# Altium schematic sheet GİRİŞ.SchDoc
size A3; SheetNumber: 1; SheetTotal: 1
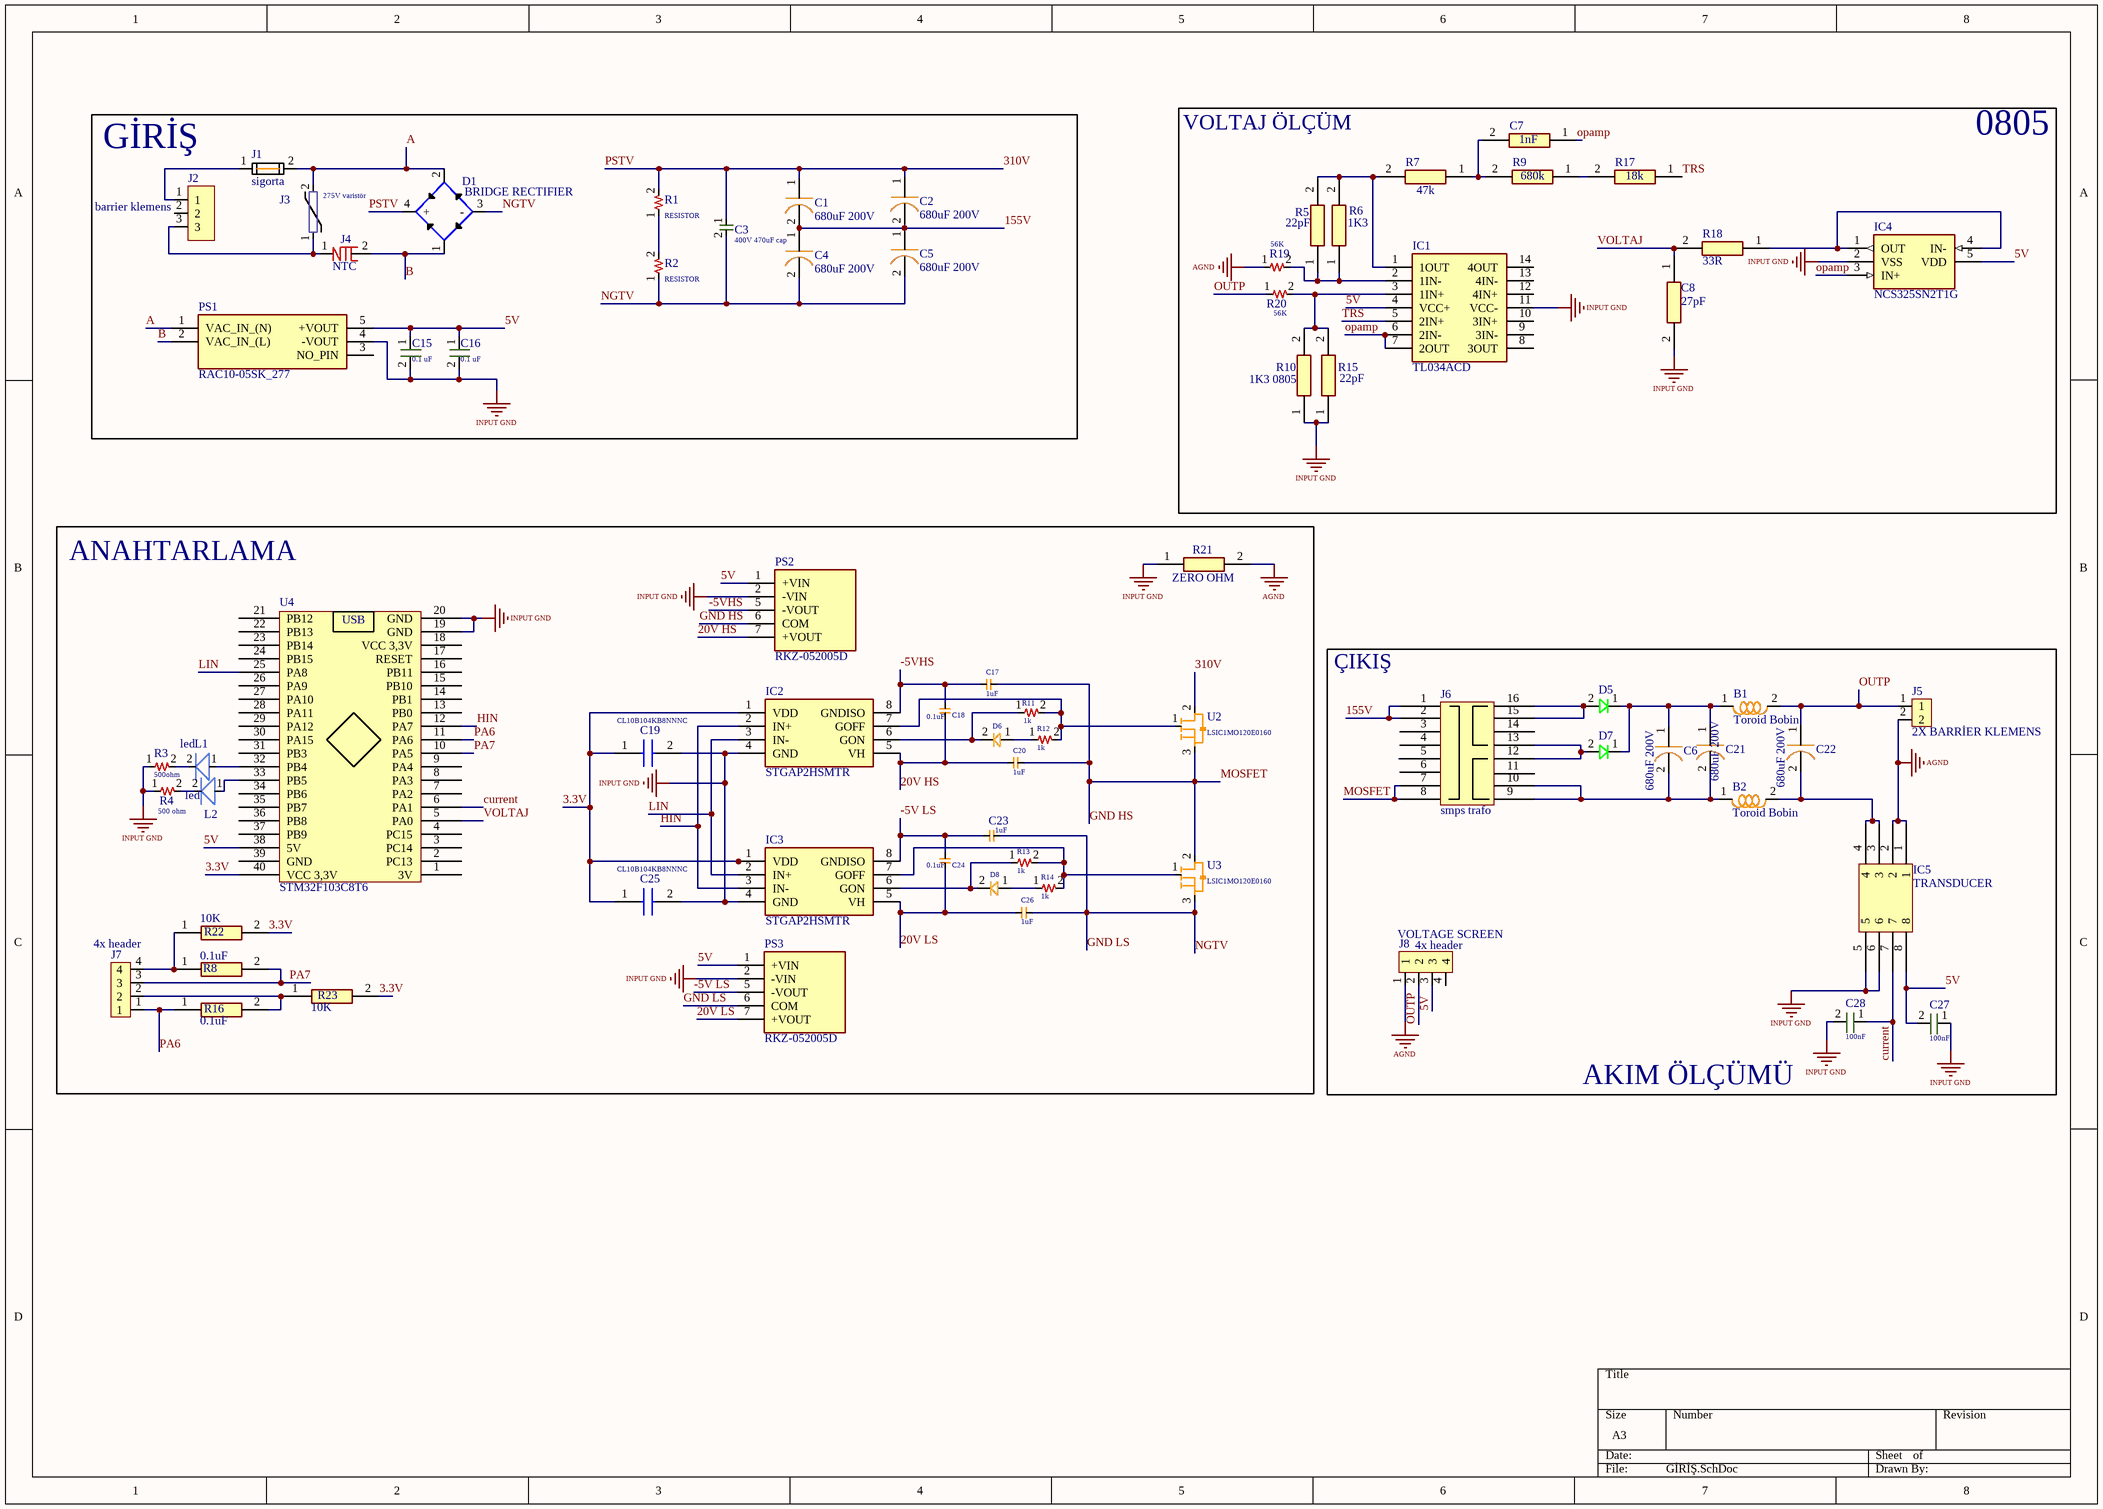
[diagram p0: GİRİŞ.SchDoc]

## Parts
B1  Toroid Bobin  [toroid bobin]
B2  Toroid Bobin  [toroid bobin]
C1  680uF 200V  [200v 680uF CAPACITOR]
C2  680uF 200V  [200v 680uF CAPACITOR]
C3  400V 470uF cap  [400V 470uF]
C4  680uF 200V  [200v 680uF CAPACITOR]
C5  680uF 200V  [200v 680uF CAPACITOR]
C6  680uF 200V  [200v 680uF CAPACITOR]
C7  1nF  [RESC2012X65N]
C8  27pF  [RESC2012X65N]
C15  0.1 uF  [0.1 uF mercimek kapasitör]
C16  0.1 uF  [0.1 uF mercimek kapasitör]
C17  1uF  [KUTU KAPASİTÖR 1uF]
C18  0.1uF  [KUTU KAPASİTÖR 1uF]
C19  CL10B104KB8NNNC  [CAPC1608X90N]
C20  1uF  [KUTU KAPASİTÖR 1uF]
C21  680uF 200V  [200v 680uF CAPACITOR]
C22  680uF 200V  [200v 680uF CAPACITOR]
C23  1uF  [KUTU KAPASİTÖR 1uF]
C24  0.1uF  [KUTU KAPASİTÖR 1uF]
C25  CL10B104KB8NNNC  [CAPC1608X90N]
C26  1uF  [KUTU KAPASİTÖR 1uF]
C27  100nF  [0.1 uF mercimek kapasitör]
C28  100nF  [0.1 uF mercimek kapasitör]
D1  BRIDGE RECTIFIER  [RECTIFIER]
D5  MUR1560 DIODE  [MUR1560 FAST DIODE]  (value not drawn)
D6  SF-26 DIODE  [SF-26 DIODE]  (value not drawn)
D7  MUR1560 DIODE  [MUR1560 FAST DIODE]  (value not drawn)
D8  SF-26 DIODE  [SF-26 DIODE]  (value not drawn)
IC1  TL034ACD  [SOIC127P600X175-14N]
IC2  STGAP2HSMTR  [SOIC127P1032X264-8N]
IC3  STGAP2HSMTR  [SOIC127P1032X264-8N]
IC4  NCS325SN2T1G  [SOT95P275X110-5N]
IC5  TRANSDUCER  [GHS 16-SME current transducer]
J1  sigorta  [FUSE HOLDER]
J2  barrier klemens  [BARRİER KLEMENS]
J3  275V varistör  [Varistor 275V]
J4  NTC  [NTC]
J5  2X BARRİER KLEMENS  [2X BARRİER KLEMENS]
J6  smps trafo  [SMPS TRAFO]
J7  4x header  [4x header]
J8  4x header  [4x header]
L1  led  [led]
L2  led  [led]
PS1  RAC10-05SK_277  [RAC1005SK277]
PS2  RKZ-052005D  [RKZ1215SH]
PS3  RKZ-052005D  [RKZ1215SH]
R1  RESISTOR  [GENERAL RESISTOR]
R2  RESISTOR  [GENERAL RESISTOR]
R3  500ohm  [GENERAL RESISTOR]
R4  500 ohm  [GENERAL RESISTOR]
R5  22pF  [RESC2012X65N]
R6  1K3  [RESC2012X65N]
R7  47k  [RESC2012X65N]
R8  0.1uF  [RESC2012X65N]
R9  680k  [RESC2012X65N]
R10  1K3 0805  [RESC2012X65N]
R11  1k  [GENERAL RESISTOR]
R12  1k  [GENERAL RESISTOR]
R13  1k  [GENERAL RESISTOR]
R14  1k  [GENERAL RESISTOR]
R15  22pF  [RESC2012X65N]
R16  0.1uF  [RESC2012X65N]
R17  18k  [RESC2012X65N]
R18  33R  [RESC2012X65N]
R19  56K  [GENERAL RESISTOR]
R20  56K  [GENERAL RESISTOR]
R21  ZERO OHM  [RESC3216X75N]
R22  10K  [RESC2012X65N]
R23  10K  [RESC2012X65N]
U2  LSIC1MO120E0160  [LSIC1MO120E0160]
U3  LSIC1MO120E0160  [LSIC1MO120E0160]
U4  STM32F103C8T6  [STM32 BLUE PİLL]

## Blocks framed on the sheet
GİRİŞ: C1-C5 C15 C16 D1 J1-J4 PS1 R1 R2
0805: C7 C8 IC1 IC4 R5-R7 R9 R10 R15 R17-R20
ANAHTARLAMA: C17-C20 C23-C26 D6 D8 IC2 IC3 J7 L1 L2 PS2 PS3 R3 R4 R8 R11-R14 R16 R21-R23 U2-U4
AKIM ÖLÇÜMÜ: B1 B2 C6 C21 C22 C27 C28 D5 D7 IC5 J5 J6 J8

## Nets
AGND: IC5.1 IC5.2 J5.2 J8.1 R19.1 R21.2
INPUT GND: C8.2 C15.2 C16.2 C19.2 C25.2 C27.1 C28.2 IC1.11(VCC-) IC2.4(GND) IC3.4(GND) IC4.2(VSS) IC5.5 IC5.6 PS1.4(-VOUT) PS2.2(-VIN) PS3.2(-VIN) R3.1 R4.1 R10.1 R15.1 R21.1 U4.19(GND) U4.20(GND)
3.3V: C19.1 C25.1 IC2.1(VDD) IC3.1(VDD) R22.2 R23.2 U4.40(VCC_3,3V)
5V: C15.1 C16.1 C27.2 IC1.4(VCC+) IC4.5(VDD) IC5.8 J8.3 PS1.5(+VOUT) PS2.1(+VIN) PS3.1(+VIN) U4.38(5V)
20V HS: C18.2 C20.1 IC2.5(VH) PS2.7(+VOUT)
20V LS: C24.2 C26.1 IC3.5(VH) PS3.7(+VOUT)
155V: C1.2 C2.2 C4.1 C5.1 J6.1 J6.2
310V: C1.1 C2.1 C3.1 D1.4(+) R1.2 U2.2(D)  [also labelled PSTV]
-5V LS: C23.1 C24.1 IC3.8(GNDISO) PS3.5(-VOUT)
-5VHS: C17.1 C18.1 IC2.8(GNDISO) PS2.5(-VOUT)
A: D1.2 J1.2 J3.2 PS1.1(VAC_IN_(N))
B: D1.1 J4.2 PS1.2(VAC_IN_(L))
current: C28.1 IC5.7 U4.6(PA1)
GND HS: C17.2 C20.2 J6.7 J6.8 PS2.6(COM) U2.3(S) U3.2(D)  [also labelled MOSFET]
GND LS: C3.2 C4.2 C5.2 C23.2 C26.2 D1.3(-) PS3.6(COM) R2.1 U3.3(S)  [also labelled NGTV]
HIN: IC2.2(IN+) IC3.3(IN-) U4.12(PA7)
LIN: IC2.3(IN-) IC3.2(IN+) U4.25(PA8)
opamp: C7.1 IC1.6(2IN-) IC1.7(2OUT) IC4.3(IN+)
OUTP: B1.2 C22.1 J5.1 J8.2 R20.1
PA6: J7.1 R16.1 U4.11(PA6)
PA7: J7.3 R8.2 U4.10(PA5)
TRS: IC1.5(2IN+) R17.1
VOLTAJ: C8.1 R18.2 U4.5(PA0)
NetB1_1: B1.1 C6.1 C21.1 D5.1 D7.1
NetB2_1: B2.1 C6.2 C21.2 J6.9 J6.10
NetB2_2: B2.2 C22.2 IC5.3 IC5.4
NetC7_2: C7.2 R7.1 R9.2
NetD5_2: D5.2 J6.15 J6.16
NetD6_1: D6.1 R12.1
NetD6_2: D6.2 IC2.6(GON) R11.1
NetD7_2: D7.2 J6.12 J6.13
NetD8_1: D8.1 R14.1
NetD8_2: D8.2 IC3.6(GON) R13.1
NetIC1_1: IC1.1(1OUT) R5.2 R6.2 R7.2
NetIC1_2: IC1.2(1IN-) R5.1 R6.1 R19.2
NetIC1_3: IC1.3(1IN+) R10.2 R15.2 R20.2
NetIC2_7: IC2.7(GOFF) R11.2 R12.2 U2.1(G)
NetIC3_7: IC3.7(GOFF) R13.2 R14.2 U3.1(G)
NetIC4_1: IC4.1(OUT) IC4.4(IN-) R18.1
NetJ1_1: J1.1 J2.1
NetJ2_3: J2.3 J3.1 J4.1
NetJ7_2: J7.2 R16.2 R23.1
NetJ7_4: J7.4 R8.1 R22.1
NetL1_1: L1.1 U4.32(PB4)
NetL1_2: L1.2 R3.2
NetL2_1: L2.1 U4.33(PB5)
NetL2_2: L2.2 R4.2
NetR1_1: R1.1 R2.2
NetR9_1: R9.1 R17.2

Not connected (* = marked no-connect by the designer): IC1 8(3OUT) 9(3IN-) 10(3IN+) 12(4IN+) 13(4IN-) 14(4OUT); J2 2; J6 3 4 5 6 11 14; J8 4; PS1 3(NO_PIN); U4 1(3V) 2(PC13) 3(PC14) 4(PC15) 7(PA2) 8(PA3) 9(PA4) 13(PB0) 14(PB1) 15(PB10) 16(PB11) 17(RESET) 18(VCC_3,3V) 21(PB12) 22(PB13) 23(PB14) 24(PB15) 26(PA9) 27(PA10) 28(PA11) 29(PA12) 30(PA15) 31(PB3) 34(PB6) 35(PB7) 36(PB8) 37(PB9) 39(GND)

## Notes on the sheet
- VOLTAJ ÖLÇÜM
- ÇIKIŞ
- (near J8) VOLTAGE SCREEN
- (in symbol stm32 blue pill) USB

## Library data of the parts
C1 C2 C4-C6 C21 C22 = 680uF 200V: CAPACITOR
C3 = 400V 470uF cap: 470 uF
C7 C8 R5-R10 R15-R18 R22 R23 = CPF0805B100RE1: Resistor; Manufacturer_Name: TE Connectivity; Datasheet Link: https://datasheet.datasheetarchive.com/originals/distributors/DKDS-21/401696.pdf; Height: 0.65mm; Manufacturer_Part_Number: CPF0805B100RE1; Mouser Part Number: 279-CPF0805B100RE1; Mouser Price/Stock: https://www.mouser.co.uk/ProductDetail/TE-Connectivity-Holsworthy/CPF0805B100RE1?qs=9ylKvqdyudkCWLPT1QvLZQ%3D%3D; Arrow Part Number: CPF0805B100RE1; Arrow Price/Stock: https://www.arrow.com/en/products/cpf0805b100re1/te-connectivity?region=nac
C15 C16 C27 C28 = 0.1 uF mercimek kapasitör: CAPACITOR
C17 C20 C23 C26 = KUTU KAPASİTÖR 1uF
C18 C24 = KUTU KAPASİTÖR 1uF: 1uF
C19 C25 = CL10B104KB8NNNC: Capacitor; Manufacturer_Name: SAMSUNG; Datasheet Link: https://datasheet.datasheetarchive.com/originals/distributors/Datasheets-DGA10/2408969.pdf; Height: 0.9mm; Manufacturer_Part_Number: CL10B104KB8NNNC; Mouser Part Number: 187-CL10B104KB8NNNC; Mouser Price/Stock: https://www.mouser.co.uk/ProductDetail/Samsung-Electro-Mechanics/CL10B104KB8NNNC?qs=349EhDEZ59rvGc2rLwVOdA%3D%3D; Arrow Part Number: CL10B104KB8NNNC; Arrow Price/Stock: https://www.arrow.com/en/products/cl10b104kb8nnnc/samsung-electro-mechanics?region=nac
D1 = BRIDGE RECTIFIER: RECTIFIER
D5 D7 = MUR1560 DIODE: DIODE
D6 D8 = SF-26 DIODE: DIODE
IC1 = TL034ACD: Integrated Circuit; Manufacturer_Name: Texas Instruments; Datasheet Link: http://www.ti.com/lit/gpn/TL034A; Height: 1.75mm; Manufacturer_Part_Number: TL034ACD; Mouser Part Number: 595-TL034ACD; Mouser Price/Stock: https://www.mouser.com/Search/Refine.aspx?Keyword=595-TL034ACD; Arrow Part Number: TL034ACD; Arrow Price/Stock: https://www.arrow.com/en/products/tl034acd/texas-instruments
IC2 IC3 = STGAP2HSMTR: Integrated Circuit; Manufacturer_Name: STMicroelectronics; Datasheet Link: https://www.st.com/resource/en/datasheet/stgap2hs.pdf; Height: 2.64mm; Manufacturer_Part_Number: STGAP2HSMTR; Mouser Part Number: 511-STGAP2HSMTR; Mouser Price/Stock: https://www.mouser.co.uk/ProductDetail/STMicroelectronics/STGAP2HSMTR?qs=DPoM0jnrROVEB9wqbhFGMA%3D%3D; Arrow Part Number: STGAP2HSMTR; Arrow Price/Stock: https://www.arrow.com/en/products/stgap2hsmtr/stmicroelectronics?region=nac
IC4 = NCS325SN2T1G: Integrated Circuit; Manufacturer_Name: onsemi; Datasheet Link: https://componentsearchengine.com/Datasheets/1/NCS325SN2T1G.pdf; Height: 1.1mm; Manufacturer_Part_Number: NCS325SN2T1G; Mouser Part Number: 863-NCS325SN2T1G; Mouser Price/Stock: https://www.mouser.co.uk/ProductDetail/onsemi/NCS325SN2T1G?qs=dbuNSGnowt2g9SoYxOxXaw%3D%3D; Arrow Part Number: NCS325SN2T1G; Arrow Price/Stock: https://www.arrow.com/en/products/ncs325sn2t1g/on-semiconductor
J2 = barrier klemens: 9.5mm
J3 = 275V varistör: VARISTOR
J4 = NTC: SİGORTA
J7 J8 = 4x header: header
PS1 = RAC10-05SK_277: Power Supply; Manufacturer_Name: RECOM Power; Manufacturer_Part_Number: RAC10-05SK/277; Datasheet Link: https://componentsearchengine.com/Datasheets/1/RAC10-05SK_277.pdf; Height: 23.5mm; Mouser Part Number: 919-RAC10-05SK/277; Mouser Price/Stock: https://www.mouser.co.uk/ProductDetail/RECOM-Power/RAC10-05SK-277?qs=j%252B1pi9TdxUZOeTKEBCMwCw%3D%3D; Arrow Part Number: RAC10-05SK/277; Arrow Price/Stock: https://www.arrow.com/en/products/rac10-05sk277/recom-power?region=europe
PS2 PS3 = RKZ-052005D: Power Supply; Manufacturer_Name: RECOM Power; Datasheet Link: https://www.recom-power.com/pdf/Econoline/RKZ-xx2005D.pdf; Height: 10.7mm; Manufacturer_Part_Number: RKZ-052005D; Mouser Part Number: 919-RKZ-052005D; Mouser Price/Stock: https://www.mouser.co.uk/ProductDetail/RECOM-Power/RKZ-052005D?qs=IbBl3rwNelPSJrfShwexQQ%3D%3D; Arrow Part Number: RKZ-052005D; Arrow Price/Stock: https://www.arrow.com/en/products/rkz-052005d/recom-power
R1-R4 R11-R14 R19 R20 = RESISTOR: GENERAL RESISTOR
R21 = CR1206-F_-2R00ELF: Resistor; Manufacturer_Name: Bourns; Manufacturer_Part_Number: CR1206-F/-2R00ELF; Height: 0.75mm; Mouser Part Number: 652-CR1206-F/2R00ELF; Mouser Price/Stock: https://www.mouser.co.uk/ProductDetail/Bourns/CR1206-F-2R00ELF?qs=W%2FMpXkg%252BdQ47Z%2FeZv1nDSg%3D%3D
U2 U3 = LSIC1MO120E0160: MOSFET
U4 = stm32 blue pill: CONTROLLER